# Altium schematic sheet USB_IN.SchDoc
size A; SheetNumber: 8; SheetTotal: 12
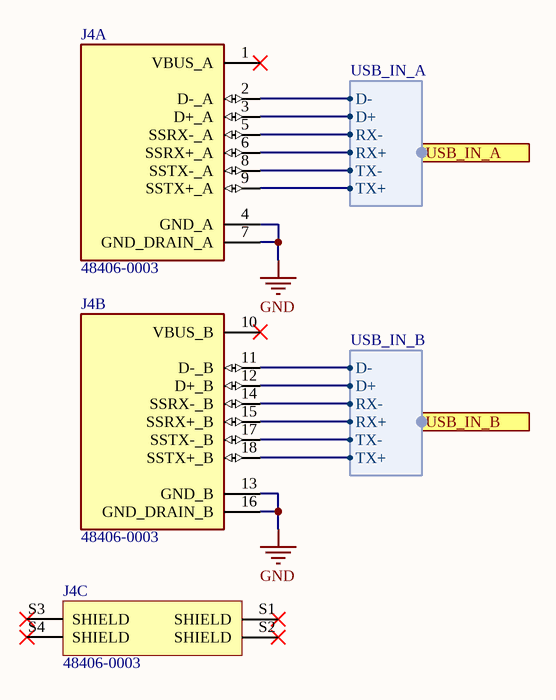
[diagram p0: USB_IN.SchDoc]

## Parts
J4  48406-0003  [MOLEX_48406]  (parts A,B,C of 3)

## Ports
USB_IN_A (harness USB_IN_A, see USB[2B], USB_SWITCH_A[1B]), USB_IN_B (harness USB_IN_B, see USB[2B], USB_SWITCH_B[1B])

## Harnesses
USB_IN_A: D+, D-, RX-, RX+, TX-, TX+
USB_IN_B: D+, D-, RX-, RX+, TX-, TX+

## Nets
GND: J4.4(GND_A) J4.7(GND_DRAIN_A) J4.13(GND_B) J4.16(GND_DRAIN_B)
NetJ4_2: J4.2(D-_A) ; port USB_IN_A.D-
NetJ4_3: J4.3(D+_A) ; port USB_IN_A.D+
NetJ4_5: J4.5(SSRX-_A) ; port USB_IN_A.RX-
NetJ4_6: J4.6(SSRX+_A) ; port USB_IN_A.RX+
NetJ4_8: J4.8(SSTX-_A) ; port USB_IN_A.TX-
NetJ4_9: J4.9(SSTX+_A) ; port USB_IN_A.TX+
NetJ4_11: J4.11(D-_B) ; port USB_IN_B.D-
NetJ4_12: J4.12(D+_B) ; port USB_IN_B.D+
NetJ4_14: J4.14(SSRX-_B) ; port USB_IN_B.RX-
NetJ4_15: J4.15(SSRX+_B) ; port USB_IN_B.RX+
NetJ4_17: J4.17(SSTX-_B) ; port USB_IN_B.TX-
NetJ4_18: J4.18(SSTX+_B) ; port USB_IN_B.TX+

Not connected (* = marked no-connect by the designer): J4 1(VBUS_A)* 10(VBUS_B)* S1(SHIELD)* S2(SHIELD)* S3(SHIELD)* S4(SHIELD)*

## Library data of the parts
J4 = 48406-0003: USB-A (USB TYPE-A), Stacked USB 3.2 Gen 1 (USB 3.1 Gen 1, Superspeed (USB 3.0)) Receptacle Connector 18 Position Through Hole, Right Angle; MF: Molex; Package: None; Check_prices: https://www.snapeda.com/parts/48406-0003/Molex/view-part/?ref=eda; Value: *; Price: None; MP: 48406-0003; Purchase-URL: https://pricing.snapeda.com/search/part/48406-0003/?ref=eda; SnapEDA_Link: https://www.snapeda.com/parts/48406-0003/Molex/view-part/?ref=snap; Availability: In Stock